# Altium schematic sheet CAN.SchDoc
size A; SheetNumber: 4; SheetTotal: 4
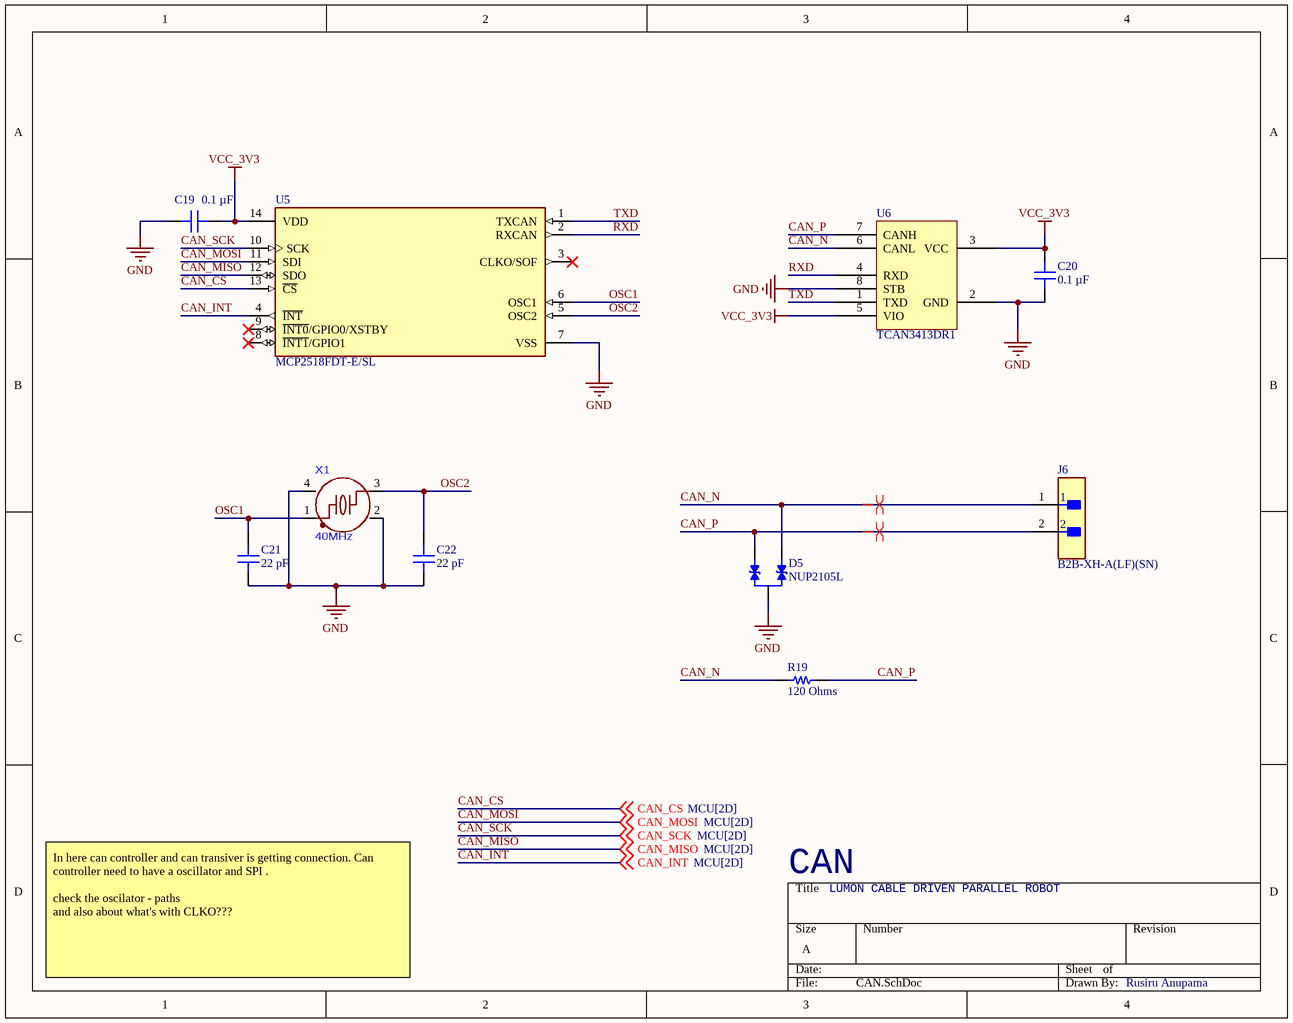
[diagram p0: CAN.SchDoc]

## Parts
C19  0.1 µF  [CAP 0805_2012]
C20  0.1 µF  [CAP 0805_2012]
C21  22 pF  [CAP 0805_2012]
C22  22 pF  [CAP 0805_2012]
D5  NUP2105L  [SOT95P240X120-3N]
J6  B2B-XH-A(LF)(SN)  [FP-B2B-XH-A_LF_SN-MFG]
R19  120 Ohms  [RES 0805_2012]
U5  MCP2518FDT-E/SL  [FP-C04-065-SL-IPC_A]
U6  TCAN3413DR1  [TCAN3413DR1]
X1  40MHz  [CRYSTAL-SMD_4P-L3.2-W2.5-BL]

## Nets
GND: C19.1 C20.1 C21.1 C22.1 D5.3 U5.7(VSS) U6.2(GND) U6.8(STB) X1.2(GND) X1.4(GND)
VCC_3V3: C19.2 C20.2 U5.14(VDD) U6.3(VCC) U6.5(VIO)
CAN_CS: U5.13(~{CS}) ; off-sheet CAN_CS
CAN_INT: U5.4(~{INT}) ; off-sheet CAN_INT
CAN_MISO: U5.12(SDO) ; off-sheet CAN_MISO
CAN_MOSI: U5.11(SDI) ; off-sheet CAN_MOSI
CAN_N: D5.1 J6.1 R19.1 U6.6(CANL)
CAN_P: D5.2 J6.2 R19.2 U6.7(CANH)
CAN_SCK: U5.10(SCK) ; off-sheet CAN_SCK
OSC1: C21.2 U5.6(OSC1) X1.1
OSC2: C22.2 U5.5(OSC2) X1.3
RXD: U5.2(RXCAN) U6.4(RXD)
TXD: U5.1(TXCAN) U6.1(TXD)

Not connected (* = marked no-connect by the designer): U5 3(CLKO/SOF)* 8(~{INT1}/GPIO1)* 9(~{INT0}/GPIO0/XSTBY)*

## Layout directives
differential pair: CAN_N, CAN_P

## Notes on the sheet
- CAN
- LUMON CABLE DRIVEN PARALLEL ROBOT
- In here can controller and can transiver is getting connection. Can controller need to have a oscillator and SPI .
  check the oscilator - paths
  and also about what's with CLKO???
- Rusiru Anupama

## Library data of the parts
C19 C20 = CC0805MRX7R9BB104: CAP CER 0.1UF 50V X7R 0805; manufacturer: Yageo; Tolerance: ±20%; Part Number: CC0805MRX7R9BB104; Capacitance: 0.1 µF; Applications: General Purpose; componentlink1description: Datasheet; componentlink1url: https://www.yageo.com/upload/media/product/productsearch/datasheet/mlcc/UPY-GPHC_X7R_6.3V-to-50V_18.pdf; componentlink2description: DigiKey Link; componentlink2url: https://www.digikey.com/en/products/detail/yageo/CC0805MRX7R9BB104/5884281; Device Package: 0805 (2012 Metric); lastupdated: 4/6/2026 7:33:19 PM; Lifecycle Status: Active; Minimum Order: 1; Mounting Type: Surface Mount, MLCC; Operating Temperature: -55°C ~ 125°C; Package / Case: 0805 (2012 Metric); packaging: TapeAndReel; partid: 2475; Part Status: Active; price: 0.01; series: CC; Size / Dimension: 0.079" L x 0.049" W (2.00mm x 1.25mm); Supplier 1: DigiKey; Supplier Part Number 1: 311-4351-1-ND; Temperature Coefficient: X7R; Thickness (Max): 0.037" (0.95mm); value: 0.1 µF; Voltage - Rated: 50V; LCSC part #: C49678; Parameter 1: *
C21 C22 = 885012007012: CAP CER 22PF 16V C0G/NP0 0805; manufacturer: Würth Elektronik; Temperature Coefficient: C0G, NP0; Tolerance: ±5%; Part Number: 885012007012; Capacitance: 22 pF; Applications: General Purpose; componentlink1description: Datasheet; componentlink1url: https://katalog.we-online.de/pbs/datasheet/885012007012.pdf; componentlink2description: DigiKey Link; componentlink2url: https://www.digikey.com/en/products/detail/würth-elektronik/885012007012/5453671; Device Package: 0805 (2012 Metric); lastupdated: 4/6/2026 7:32:47 PM; Lifecycle Status: Active; Minimum Order: 1; Mounting Type: Surface Mount, MLCC; Operating Temperature: -55°C ~ 125°C; Package / Case: 0805 (2012 Metric); packaging: TapeAndReel; partid: 11782; Part Status: Active; price: 0.03; series: WCAP-CSGP; Size / Dimension: 0.079" L x 0.049" W (2.00mm x 1.25mm); Supplier 1: DigiKey; Supplier Part Number 1: 732-7816-1-ND; Thickness (Max): 0.028" (0.70mm); value: 22 pF; Voltage - Rated: 16V; LCSC part #: C1804
D5 = NUP2105L: ESD, SOT-23, 0.1ÂµA, 24V, Unidir; MF: Diotec Semiconductor; SnapEDA_Link: https://www.snapeda.com/parts/NUP2105L/Diotec/view-part/?ref=snap; Package: SOT-23 Diotec; Value: *; MP: NUP2105L; Check_prices: https://www.snapeda.com/parts/NUP2105L/Diotec/view-part/?ref=eda; LCSC part #: C14486
J6 = CMP-2000-05888-3: CONN HEADER VERT 2POS 2.5MM; Current Rating: 3A; Voltage Rating: 250V; Number of Contacts: 2; Contact Resistance: 20mR; Wire/Cable Gauge: 22AWG; Insulation Resistance: 1GR; Connector Type: Male Pin; Packaging: Bulk; Contact Material: Brass; Lead Free: Lead Free; Orientation: Straight; Contact Plating: Tin; Max Current Rating: 3A; Termination: Solder; Fastening Type: Detent; Depth: 5.75mm; Housing Material: Polyamide; REACH SVHC: No SVHC; Series: XH; Voltage Rating (AC): 250V; Number of Positions: 2; Color: Natural; Contact Type: Male Pin; Max Voltage Rating (DC): 250V; Pitch: 2.5mm; Lead Pitch: 2.5mm; Mount: Through Hole; Max Operating Temperature: 85°C; Length: 7.4mm; Max Voltage Rating (AC): 250V; Min Operating Temperature: -25°C; Number of Rows: 1; Housing Color: White; LCSC part #: C19271386
R19 = CRCW0805120RFKEAHP: RES SMD 120 OHM 1% 1/2W 0805; Manufacturer: Vishay Dale; Power (Watts): 0.5W, 1/2W; Temperature Coefficient: ±100ppm/°C; Part Number: CRCW0805120RFKEAHP; Value: 120 Ohms; ComponentLink1Description: Datasheet; ComponentLink1URL: http://www.vishay.com/docs/20043/crcwhpe3.pdf; ComponentLink2Description: DigiKey Link; ComponentLink2URL: https://www.digikey.com/en/products/detail/vishay-dale/CRCW0805120RFKEAHP/2226864; Composition: Thick Film; Device Package: 0805 (2012 Metric); Features: Automotive AEC-Q200, Pulse Withstanding; Height - Seated (Max): 0.024" (0.60mm); LastUpdated: 4/5/2026 8:11:15 PM; Lifecycle Status: Active; Minimum Order: 1; Number of Terminations: 2; Operating Temperature: -55°C ~ 155°C; Package / Case: 0805 (2012 Metric); Packaging: TapeAndReel; PartId: 30328; Part Status: Active; Price: 0.02; Ratings: AEC-Q200; Resistance: 120 Ohms; Series: CRCW-HP e3; Size / Dimension: 0.079" L x 0.049" W (2.00mm x 1.25mm); Supplier 1: DigiKey; Supplier Part Number 1: 541-120TCT-ND; Supplier Device Package: 0805; Tolerance: ±1%; LCSC part #: C410053
U5 = CMP-06298-000019-1: IC CAN CONTROLLER SPI 14SOIC; RoHS Compliant: Yes; LCSC part #: C626758
X1 = XL2EL89CPI-111YLC-40M: LCSC part #: C5444549
U6 = TCAN3413DR1: LCSC part #: C22396693